# Altium schematic sheet clock_led_face.SchDoc: Display
size 290 x 209 mm; Author: chs; SheetNumber: 3; SheetTotal: 3
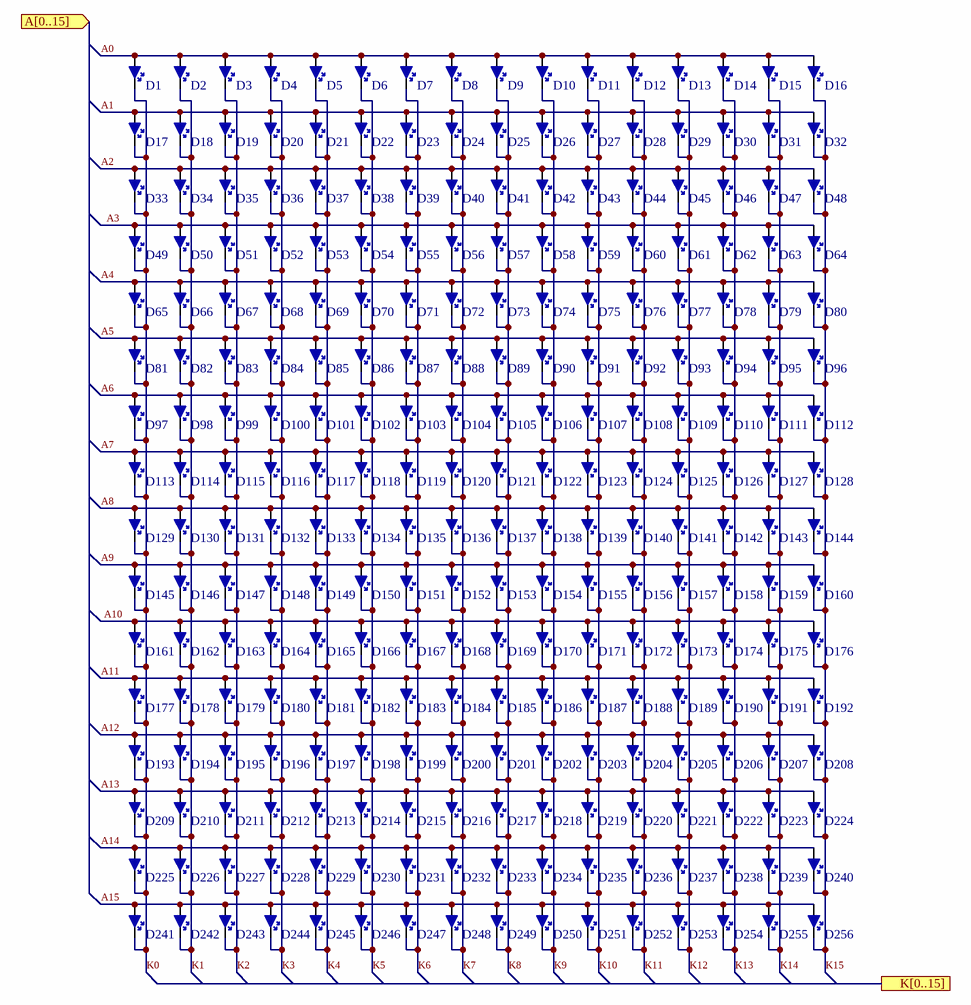
[diagram p0: clock_led_face.SchDoc]

## Parts
D1  LED  [LED_0402]  (value not drawn)
D2  LED  [LED_0402]  (value not drawn)
D3  LED  [LED_0402]  (value not drawn)
D4  LED  [LED_0402]  (value not drawn)
D5  LED  [LED_0402]  (value not drawn)
D6  LED  [LED_0402]  (value not drawn)
D7  LED  [LED_0402]  (value not drawn)
D8  LED  [LED_0402]  (value not drawn)
D9  LED  [LED_0402]  (value not drawn)
D10  LED  [LED_0402]  (value not drawn)
D11  LED  [LED_0402]  (value not drawn)
D12  LED  [LED_0402]  (value not drawn)
D13  LED  [LED_0402]  (value not drawn)
D14  LED  [LED_0402]  (value not drawn)
D15  LED  [LED_0402]  (value not drawn)
D16  LED  [LED_0402]  (value not drawn)
D17  LED  [LED_0402]  (value not drawn)
D18  LED  [LED_0402]  (value not drawn)
D19  LED  [LED_0402]  (value not drawn)
D20  LED  [LED_0402]  (value not drawn)
D21  LED  [LED_0402]  (value not drawn)
D22  LED  [LED_0402]  (value not drawn)
D23  LED  [LED_0402]  (value not drawn)
D24  LED  [LED_0402]  (value not drawn)
D25  LED  [LED_0402]  (value not drawn)
D26  LED  [LED_0402]  (value not drawn)
D27  LED  [LED_0402]  (value not drawn)
D28  LED  [LED_0402]  (value not drawn)
D29  LED  [LED_0402]  (value not drawn)
D30  LED  [LED_0402]  (value not drawn)
D31  LED  [LED_0402]  (value not drawn)
D32  LED  [LED_0402]  (value not drawn)
D33  LED  [LED_0402]  (value not drawn)
D34  LED  [LED_0402]  (value not drawn)
D35  LED  [LED_0402]  (value not drawn)
D36  LED  [LED_0402]  (value not drawn)
D37  LED  [LED_0402]  (value not drawn)
D38  LED  [LED_0402]  (value not drawn)
D39  LED  [LED_0402]  (value not drawn)
D40  LED  [LED_0402]  (value not drawn)
D41  LED  [LED_0402]  (value not drawn)
D42  LED  [LED_0402]  (value not drawn)
D43  LED  [LED_0402]  (value not drawn)
D44  LED  [LED_0402]  (value not drawn)
D45  LED  [LED_0402]  (value not drawn)
D46  LED  [LED_0402]  (value not drawn)
D47  LED  [LED_0402]  (value not drawn)
D48  LED  [LED_0402]  (value not drawn)
D49  LED  [LED_0402]  (value not drawn)
D50  LED  [LED_0402]  (value not drawn)
D51  LED  [LED_0402]  (value not drawn)
D52  LED  [LED_0402]  (value not drawn)
D53  LED  [LED_0402]  (value not drawn)
D54  LED  [LED_0402]  (value not drawn)
D55  LED  [LED_0402]  (value not drawn)
D56  LED  [LED_0402]  (value not drawn)
D57  LED  [LED_0402]  (value not drawn)
D58  LED  [LED_0402]  (value not drawn)
D59  LED  [LED_0402]  (value not drawn)
D60  LED  [LED_0402]  (value not drawn)
D61  LED  [LED_0402]  (value not drawn)
D62  LED  [LED_0402]  (value not drawn)
D63  LED  [LED_0402]  (value not drawn)
D64  LED  [LED_0402]  (value not drawn)
D65  LED  [LED_0402]  (value not drawn)
D66  LED  [LED_0402]  (value not drawn)
D67  LED  [LED_0402]  (value not drawn)
D68  LED  [LED_0402]  (value not drawn)
D69  LED  [LED_0402]  (value not drawn)
D70  LED  [LED_0402]  (value not drawn)
D71  LED  [LED_0402]  (value not drawn)
D72  LED  [LED_0402]  (value not drawn)
D73  LED  [LED_0402]  (value not drawn)
D74  LED  [LED_0402]  (value not drawn)
D75  LED  [LED_0402]  (value not drawn)
D76  LED  [LED_0402]  (value not drawn)
D77  LED  [LED_0402]  (value not drawn)
D78  LED  [LED_0402]  (value not drawn)
D79  LED  [LED_0402]  (value not drawn)
D80  LED  [LED_0402]  (value not drawn)
D81  LED  [LED_0402]  (value not drawn)
D82  LED  [LED_0402]  (value not drawn)
D83  LED  [LED_0402]  (value not drawn)
D84  LED  [LED_0402]  (value not drawn)
D85  LED  [LED_0402]  (value not drawn)
D86  LED  [LED_0402]  (value not drawn)
D87  LED  [LED_0402]  (value not drawn)
D88  LED  [LED_0402]  (value not drawn)
D89  LED  [LED_0402]  (value not drawn)
D90  LED  [LED_0402]  (value not drawn)
D91  LED  [LED_0402]  (value not drawn)
D92  LED  [LED_0402]  (value not drawn)
D93  LED  [LED_0402]  (value not drawn)
D94  LED  [LED_0402]  (value not drawn)
D95  LED  [LED_0402]  (value not drawn)
D96  LED  [LED_0402]  (value not drawn)
D97  LED  [LED_0402]  (value not drawn)
D98  LED  [LED_0402]  (value not drawn)
D99  LED  [LED_0402]  (value not drawn)
D100  LED  [LED_0402]  (value not drawn)
D101  LED  [LED_0402]  (value not drawn)
D102  LED  [LED_0402]  (value not drawn)
D103  LED  [LED_0402]  (value not drawn)
D104  LED  [LED_0402]  (value not drawn)
D105  LED  [LED_0402]  (value not drawn)
D106  LED  [LED_0402]  (value not drawn)
D107  LED  [LED_0402]  (value not drawn)
D108  LED  [LED_0402]  (value not drawn)
D109  LED  [LED_0402]  (value not drawn)
D110  LED  [LED_0402]  (value not drawn)
D111  LED  [LED_0402]  (value not drawn)
D112  LED  [LED_0402]  (value not drawn)
D113  LED  [LED_0402]  (value not drawn)
D114  LED  [LED_0402]  (value not drawn)
D115  LED  [LED_0402]  (value not drawn)
D116  LED  [LED_0402]  (value not drawn)
D117  LED  [LED_0402]  (value not drawn)
D118  LED  [LED_0402]  (value not drawn)
D119  LED  [LED_0402]  (value not drawn)
D120  LED  [LED_0402]  (value not drawn)
D121  LED  [LED_0402]  (value not drawn)
D122  LED  [LED_0402]  (value not drawn)
D123  LED  [LED_0402]  (value not drawn)
D124  LED  [LED_0402]  (value not drawn)
D125  LED  [LED_0402]  (value not drawn)
D126  LED  [LED_0402]  (value not drawn)
D127  LED  [LED_0402]  (value not drawn)
D128  LED  [LED_0402]  (value not drawn)
D129  LED  [LED_0402]  (value not drawn)
D130  LED  [LED_0402]  (value not drawn)
D131  LED  [LED_0402]  (value not drawn)
D132  LED  [LED_0402]  (value not drawn)
D133  LED  [LED_0402]  (value not drawn)
D134  LED  [LED_0402]  (value not drawn)
D135  LED  [LED_0402]  (value not drawn)
D136  LED  [LED_0402]  (value not drawn)
D137  LED  [LED_0402]  (value not drawn)
D138  LED  [LED_0402]  (value not drawn)
D139  LED  [LED_0402]  (value not drawn)
D140  LED  [LED_0402]  (value not drawn)
D141  LED  [LED_0402]  (value not drawn)
D142  LED  [LED_0402]  (value not drawn)
D143  LED  [LED_0402]  (value not drawn)
D144  LED  [LED_0402]  (value not drawn)
D145  LED  [LED_0402]  (value not drawn)
D146  LED  [LED_0402]  (value not drawn)
D147  LED  [LED_0402]  (value not drawn)
D148  LED  [LED_0402]  (value not drawn)
D149  LED  [LED_0402]  (value not drawn)
D150  LED  [LED_0402]  (value not drawn)
D151  LED  [LED_0402]  (value not drawn)
D152  LED  [LED_0402]  (value not drawn)
D153  LED  [LED_0402]  (value not drawn)
D154  LED  [LED_0402]  (value not drawn)
D155  LED  [LED_0402]  (value not drawn)
D156  LED  [LED_0402]  (value not drawn)
D157  LED  [LED_0402]  (value not drawn)
D158  LED  [LED_0402]  (value not drawn)
D159  LED  [LED_0402]  (value not drawn)
D160  LED  [LED_0402]  (value not drawn)
D161  LED  [LED_0402]  (value not drawn)
D162  LED  [LED_0402]  (value not drawn)
D163  LED  [LED_0402]  (value not drawn)
D164  LED  [LED_0402]  (value not drawn)
D165  LED  [LED_0402]  (value not drawn)
D166  LED  [LED_0402]  (value not drawn)
D167  LED  [LED_0402]  (value not drawn)
D168  LED  [LED_0402]  (value not drawn)
D169  LED  [LED_0402]  (value not drawn)
D170  LED  [LED_0402]  (value not drawn)
D171  LED  [LED_0402]  (value not drawn)
D172  LED  [LED_0402]  (value not drawn)
D173  LED  [LED_0402]  (value not drawn)
D174  LED  [LED_0402]  (value not drawn)
D175  LED  [LED_0402]  (value not drawn)
D176  LED  [LED_0402]  (value not drawn)
D177  LED  [LED_0402]  (value not drawn)
D178  LED  [LED_0402]  (value not drawn)
D179  LED  [LED_0402]  (value not drawn)
D180  LED  [LED_0402]  (value not drawn)
D181  LED  [LED_0402]  (value not drawn)
D182  LED  [LED_0402]  (value not drawn)
D183  LED  [LED_0402]  (value not drawn)
D184  LED  [LED_0402]  (value not drawn)
D185  LED  [LED_0402]  (value not drawn)
D186  LED  [LED_0402]  (value not drawn)
D187  LED  [LED_0402]  (value not drawn)
D188  LED  [LED_0402]  (value not drawn)
D189  LED  [LED_0402]  (value not drawn)
D190  LED  [LED_0402]  (value not drawn)
D191  LED  [LED_0402]  (value not drawn)
D192  LED  [LED_0402]  (value not drawn)
D193  LED  [LED_0402]  (value not drawn)
D194  LED  [LED_0402]  (value not drawn)
D195  LED  [LED_0402]  (value not drawn)
D196  LED  [LED_0402]  (value not drawn)
D197  LED  [LED_0402]  (value not drawn)
D198  LED  [LED_0402]  (value not drawn)
D199  LED  [LED_0402]  (value not drawn)
D200  LED  [LED_0402]  (value not drawn)
D201  LED  [LED_0402]  (value not drawn)
D202  LED  [LED_0402]  (value not drawn)
D203  LED  [LED_0402]  (value not drawn)
D204  LED  [LED_0402]  (value not drawn)
D205  LED  [LED_0402]  (value not drawn)
D206  LED  [LED_0402]  (value not drawn)
D207  LED  [LED_0402]  (value not drawn)
D208  LED  [LED_0402]  (value not drawn)
D209  LED  [LED_0402]  (value not drawn)
D210  LED  [LED_0402]  (value not drawn)
D211  LED  [LED_0402]  (value not drawn)
D212  LED  [LED_0402]  (value not drawn)
D213  LED  [LED_0402]  (value not drawn)
D214  LED  [LED_0402]  (value not drawn)
D215  LED  [LED_0402]  (value not drawn)
D216  LED  [LED_0402]  (value not drawn)
D217  LED  [LED_0402]  (value not drawn)
D218  LED  [LED_0402]  (value not drawn)
D219  LED  [LED_0402]  (value not drawn)
D220  LED  [LED_0402]  (value not drawn)
D221  LED  [LED_0402]  (value not drawn)
D222  LED  [LED_0402]  (value not drawn)
D223  LED  [LED_0402]  (value not drawn)
D224  LED  [LED_0402]  (value not drawn)
D225  LED  [LED_0402]  (value not drawn)
D226  LED  [LED_0402]  (value not drawn)
D227  LED  [LED_0402]  (value not drawn)
D228  LED  [LED_0402]  (value not drawn)
D229  LED  [LED_0402]  (value not drawn)
D230  LED  [LED_0402]  (value not drawn)
D231  LED  [LED_0402]  (value not drawn)
D232  LED  [LED_0402]  (value not drawn)
D233  LED  [LED_0402]  (value not drawn)
D234  LED  [LED_0402]  (value not drawn)
D235  LED  [LED_0402]  (value not drawn)
D236  LED  [LED_0402]  (value not drawn)
D237  LED  [LED_0402]  (value not drawn)
D238  LED  [LED_0402]  (value not drawn)
D239  LED  [LED_0402]  (value not drawn)
D240  LED  [LED_0402]  (value not drawn)
D241  LED  [LED_0402]  (value not drawn)
D242  LED  [LED_0402]  (value not drawn)
D243  LED  [LED_0402]  (value not drawn)
D244  LED  [LED_0402]  (value not drawn)
D245  LED  [LED_0402]  (value not drawn)
D246  LED  [LED_0402]  (value not drawn)
D247  LED  [LED_0402]  (value not drawn)
D248  LED  [LED_0402]  (value not drawn)
D249  LED  [LED_0402]  (value not drawn)
D250  LED  [LED_0402]  (value not drawn)
D251  LED  [LED_0402]  (value not drawn)
D252  LED  [LED_0402]  (value not drawn)
D253  LED  [LED_0402]  (value not drawn)
D254  LED  [LED_0402]  (value not drawn)
D255  LED  [LED_0402]  (value not drawn)
D256  LED  [LED_0402]  (value not drawn)

## Ports
A[0..15] (in), K[0..15]

## Nets
A0: D1.2(A) D2.2(A) D3.2(A) D4.2(A) D5.2(A) D6.2(A) D7.2(A) D8.2(A) D9.2(A) D10.2(A) D11.2(A) D12.2(A) D13.2(A) D14.2(A) D15.2(A) D16.2(A)
A1: D17.2(A) D18.2(A) D19.2(A) D20.2(A) D21.2(A) D22.2(A) D23.2(A) D24.2(A) D25.2(A) D26.2(A) D27.2(A) D28.2(A) D29.2(A) D30.2(A) D31.2(A) D32.2(A)
A2: D33.2(A) D34.2(A) D35.2(A) D36.2(A) D37.2(A) D38.2(A) D39.2(A) D40.2(A) D41.2(A) D42.2(A) D43.2(A) D44.2(A) D45.2(A) D46.2(A) D47.2(A) D48.2(A)
A3: D49.2(A) D50.2(A) D51.2(A) D52.2(A) D53.2(A) D54.2(A) D55.2(A) D56.2(A) D57.2(A) D58.2(A) D59.2(A) D60.2(A) D61.2(A) D62.2(A) D63.2(A) D64.2(A)
A4: D65.2(A) D66.2(A) D67.2(A) D68.2(A) D69.2(A) D70.2(A) D71.2(A) D72.2(A) D73.2(A) D74.2(A) D75.2(A) D76.2(A) D77.2(A) D78.2(A) D79.2(A) D80.2(A)
A5: D81.2(A) D82.2(A) D83.2(A) D84.2(A) D85.2(A) D86.2(A) D87.2(A) D88.2(A) D89.2(A) D90.2(A) D91.2(A) D92.2(A) D93.2(A) D94.2(A) D95.2(A) D96.2(A)
A6: D97.2(A) D98.2(A) D99.2(A) D100.2(A) D101.2(A) D102.2(A) D103.2(A) D104.2(A) D105.2(A) D106.2(A) D107.2(A) D108.2(A) D109.2(A) D110.2(A) D111.2(A) D112.2(A)
A7: D113.2(A) D114.2(A) D115.2(A) D116.2(A) D117.2(A) D118.2(A) D119.2(A) D120.2(A) D121.2(A) D122.2(A) D123.2(A) D124.2(A) D125.2(A) D126.2(A) D127.2(A) D128.2(A)
A8: D129.2(A) D130.2(A) D131.2(A) D132.2(A) D133.2(A) D134.2(A) D135.2(A) D136.2(A) D137.2(A) D138.2(A) D139.2(A) D140.2(A) D141.2(A) D142.2(A) D143.2(A) D144.2(A)
A9: D145.2(A) D146.2(A) D147.2(A) D148.2(A) D149.2(A) D150.2(A) D151.2(A) D152.2(A) D153.2(A) D154.2(A) D155.2(A) D156.2(A) D157.2(A) D158.2(A) D159.2(A) D160.2(A)
A10: D161.2(A) D162.2(A) D163.2(A) D164.2(A) D165.2(A) D166.2(A) D167.2(A) D168.2(A) D169.2(A) D170.2(A) D171.2(A) D172.2(A) D173.2(A) D174.2(A) D175.2(A) D176.2(A)
A11: D177.2(A) D178.2(A) D179.2(A) D180.2(A) D181.2(A) D182.2(A) D183.2(A) D184.2(A) D185.2(A) D186.2(A) D187.2(A) D188.2(A) D189.2(A) D190.2(A) D191.2(A) D192.2(A)
A12: D193.2(A) D194.2(A) D195.2(A) D196.2(A) D197.2(A) D198.2(A) D199.2(A) D200.2(A) D201.2(A) D202.2(A) D203.2(A) D204.2(A) D205.2(A) D206.2(A) D207.2(A) D208.2(A)
A13: D209.2(A) D210.2(A) D211.2(A) D212.2(A) D213.2(A) D214.2(A) D215.2(A) D216.2(A) D217.2(A) D218.2(A) D219.2(A) D220.2(A) D221.2(A) D222.2(A) D223.2(A) D224.2(A)
A14: D225.2(A) D226.2(A) D227.2(A) D228.2(A) D229.2(A) D230.2(A) D231.2(A) D232.2(A) D233.2(A) D234.2(A) D235.2(A) D236.2(A) D237.2(A) D238.2(A) D239.2(A) D240.2(A)
A15: D241.2(A) D242.2(A) D243.2(A) D244.2(A) D245.2(A) D246.2(A) D247.2(A) D248.2(A) D249.2(A) D250.2(A) D251.2(A) D252.2(A) D253.2(A) D254.2(A) D255.2(A) D256.2(A)
K0: D1.1(C) D17.1(C) D33.1(C) D49.1(C) D65.1(C) D81.1(C) D97.1(C) D113.1(C) D129.1(C) D145.1(C) D161.1(C) D177.1(C) D193.1(C) D209.1(C) D225.1(C) D241.1(C)
K1: D2.1(C) D18.1(C) D34.1(C) D50.1(C) D66.1(C) D82.1(C) D98.1(C) D114.1(C) D130.1(C) D146.1(C) D162.1(C) D178.1(C) D194.1(C) D210.1(C) D226.1(C) D242.1(C)
K2: D3.1(C) D19.1(C) D35.1(C) D51.1(C) D67.1(C) D83.1(C) D99.1(C) D115.1(C) D131.1(C) D147.1(C) D163.1(C) D179.1(C) D195.1(C) D211.1(C) D227.1(C) D243.1(C)
K3: D4.1(C) D20.1(C) D36.1(C) D52.1(C) D68.1(C) D84.1(C) D100.1(C) D116.1(C) D132.1(C) D148.1(C) D164.1(C) D180.1(C) D196.1(C) D212.1(C) D228.1(C) D244.1(C)
K4: D5.1(C) D21.1(C) D37.1(C) D53.1(C) D69.1(C) D85.1(C) D101.1(C) D117.1(C) D133.1(C) D149.1(C) D165.1(C) D181.1(C) D197.1(C) D213.1(C) D229.1(C) D245.1(C)
K5: D6.1(C) D22.1(C) D38.1(C) D54.1(C) D70.1(C) D86.1(C) D102.1(C) D118.1(C) D134.1(C) D150.1(C) D166.1(C) D182.1(C) D198.1(C) D214.1(C) D230.1(C) D246.1(C)
K6: D7.1(C) D23.1(C) D39.1(C) D55.1(C) D71.1(C) D87.1(C) D103.1(C) D119.1(C) D135.1(C) D151.1(C) D167.1(C) D183.1(C) D199.1(C) D215.1(C) D231.1(C) D247.1(C)
K7: D8.1(C) D24.1(C) D40.1(C) D56.1(C) D72.1(C) D88.1(C) D104.1(C) D120.1(C) D136.1(C) D152.1(C) D168.1(C) D184.1(C) D200.1(C) D216.1(C) D232.1(C) D248.1(C)
K8: D9.1(C) D25.1(C) D41.1(C) D57.1(C) D73.1(C) D89.1(C) D105.1(C) D121.1(C) D137.1(C) D153.1(C) D169.1(C) D185.1(C) D201.1(C) D217.1(C) D233.1(C) D249.1(C)
K9: D10.1(C) D26.1(C) D42.1(C) D58.1(C) D74.1(C) D90.1(C) D106.1(C) D122.1(C) D138.1(C) D154.1(C) D170.1(C) D186.1(C) D202.1(C) D218.1(C) D234.1(C) D250.1(C)
K10: D11.1(C) D27.1(C) D43.1(C) D59.1(C) D75.1(C) D91.1(C) D107.1(C) D123.1(C) D139.1(C) D155.1(C) D171.1(C) D187.1(C) D203.1(C) D219.1(C) D235.1(C) D251.1(C)
K11: D12.1(C) D28.1(C) D44.1(C) D60.1(C) D76.1(C) D92.1(C) D108.1(C) D124.1(C) D140.1(C) D156.1(C) D172.1(C) D188.1(C) D204.1(C) D220.1(C) D236.1(C) D252.1(C)
K12: D13.1(C) D29.1(C) D45.1(C) D61.1(C) D77.1(C) D93.1(C) D109.1(C) D125.1(C) D141.1(C) D157.1(C) D173.1(C) D189.1(C) D205.1(C) D221.1(C) D237.1(C) D253.1(C)
K13: D14.1(C) D30.1(C) D46.1(C) D62.1(C) D78.1(C) D94.1(C) D110.1(C) D126.1(C) D142.1(C) D158.1(C) D174.1(C) D190.1(C) D206.1(C) D222.1(C) D238.1(C) D254.1(C)
K14: D15.1(C) D31.1(C) D47.1(C) D63.1(C) D79.1(C) D95.1(C) D111.1(C) D127.1(C) D143.1(C) D159.1(C) D175.1(C) D191.1(C) D207.1(C) D223.1(C) D239.1(C) D255.1(C)
K15: D16.1(C) D32.1(C) D48.1(C) D64.1(C) D80.1(C) D96.1(C) D112.1(C) D128.1(C) D144.1(C) D160.1(C) D176.1(C) D192.1(C) D208.1(C) D224.1(C) D240.1(C) D256.1(C)

## Library data of the parts
D1-D256 = LED: Red 0402 SMD LED; JLCPCB: C25503345
  D1-D13 D17-D29 D33-D45 D49-D61 D65-D77 D81-D93 D97-D109 D113-D125 D129-D141 D145-D157 D161-D173 D177-D189 D193-D205 D209-D221: CLassName: LED_MATRIX